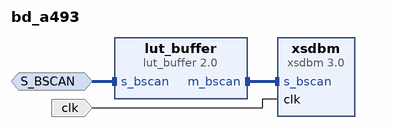
[diagram p0: block diagram of the top level]
# Vivado block design bd_a493, xcvu9p-flgb2104-2-i, Vivado 2017.1_sdxop
create_bd_design bd_a493

create_bd_intf_port -mode Slave -vlnv xilinx.com:interface:bscan_rtl:1.0 S_BSCAN
create_bd_port -dir I -type clk clk

create_bd_cell -type ip -vlnv xilinx.com:ip:xsdbm:3.0 xsdbm
set_property -dict [list \
  CONFIG.C_EN_BSCANID_VEC false \
  CONFIG.C_TWO_PRIM_MODE false \
  CONFIG.C_USE_EXT_BSCAN true \
  CONFIG.C_USE_STARTUP_CLK false \
  CONFIG.C_ENABLE_CLK_DIVIDER false \
  CONFIG.C_USER_SCAN_CHAIN 1 \
  CONFIG.C_CORE_TYPE 1 \
  CONFIG.C_EN_INT_SIM 1 \
  CONFIG.C_DCLK_HAS_RESET 0 \
  CONFIG.C_USE_BUFR 0 \
  CONFIG.C_XSDB_NUM_SLAVES 0 \
  CONFIG.C_CORE_MINOR_ALPHA_VER 97 \
  CONFIG.C_CORE_MINOR_VER 0 \
  CONFIG.C_CORE_MAJOR_VER 1 \
  CONFIG.C_BUILD_REVISION 0 \
  CONFIG.C_MINOR_VERSION 1 \
  CONFIG.C_MAJOR_VERSION 14 \
  CONFIG.C_FIFO_STYLE SUBCORE \
  CONFIG.C_CLK_INPUT_FREQ_HZ 300000000 \
] [get_bd_cells xsdbm]
create_bd_cell -type ip -vlnv xilinx.com:ip:lut_buffer:2.0 lut_buffer
set_property -dict {CONFIG.C_EN_BSCANID_VEC false} [get_bd_cells lut_buffer]

# ---- connections ----

connect_bd_intf_net [get_bd_intf_pins lut_buffer/m_bscan] [get_bd_intf_pins xsdbm/s_bscan]
connect_bd_intf_net [get_bd_intf_ports S_BSCAN] [get_bd_intf_pins lut_buffer/s_bscan]
connect_bd_net [get_bd_ports clk] [get_bd_pins xsdbm/clk]

validate_bd_design
save_bd_design
